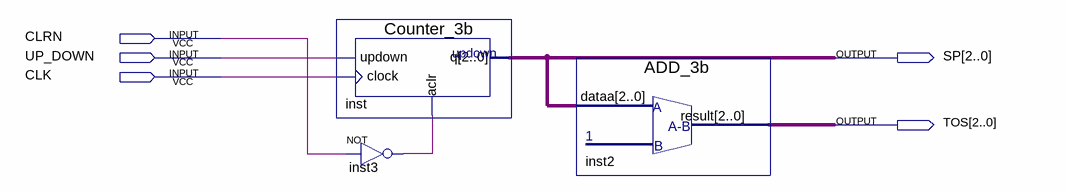
[diagram p0: schematic sheet]
// Quartus schematic SP_CNT.bdf as structural Verilog: 3 symbols, 5 pins
module SP_CNT (
  input  CLRN,
  input  UP_DOWN,
  input  CLK,
  output [2:0] SP,
  output [2:0] TOS
);

  wire inst3_out;

  Counter_3b inst (.updown(UP_DOWN), .clock(CLK), .aclr(inst3_out), .q(SP));
  not inst3 (inst3_out, CLRN);
  ADD_3b inst2 (.dataa(SP), .result(TOS));
endmodule
